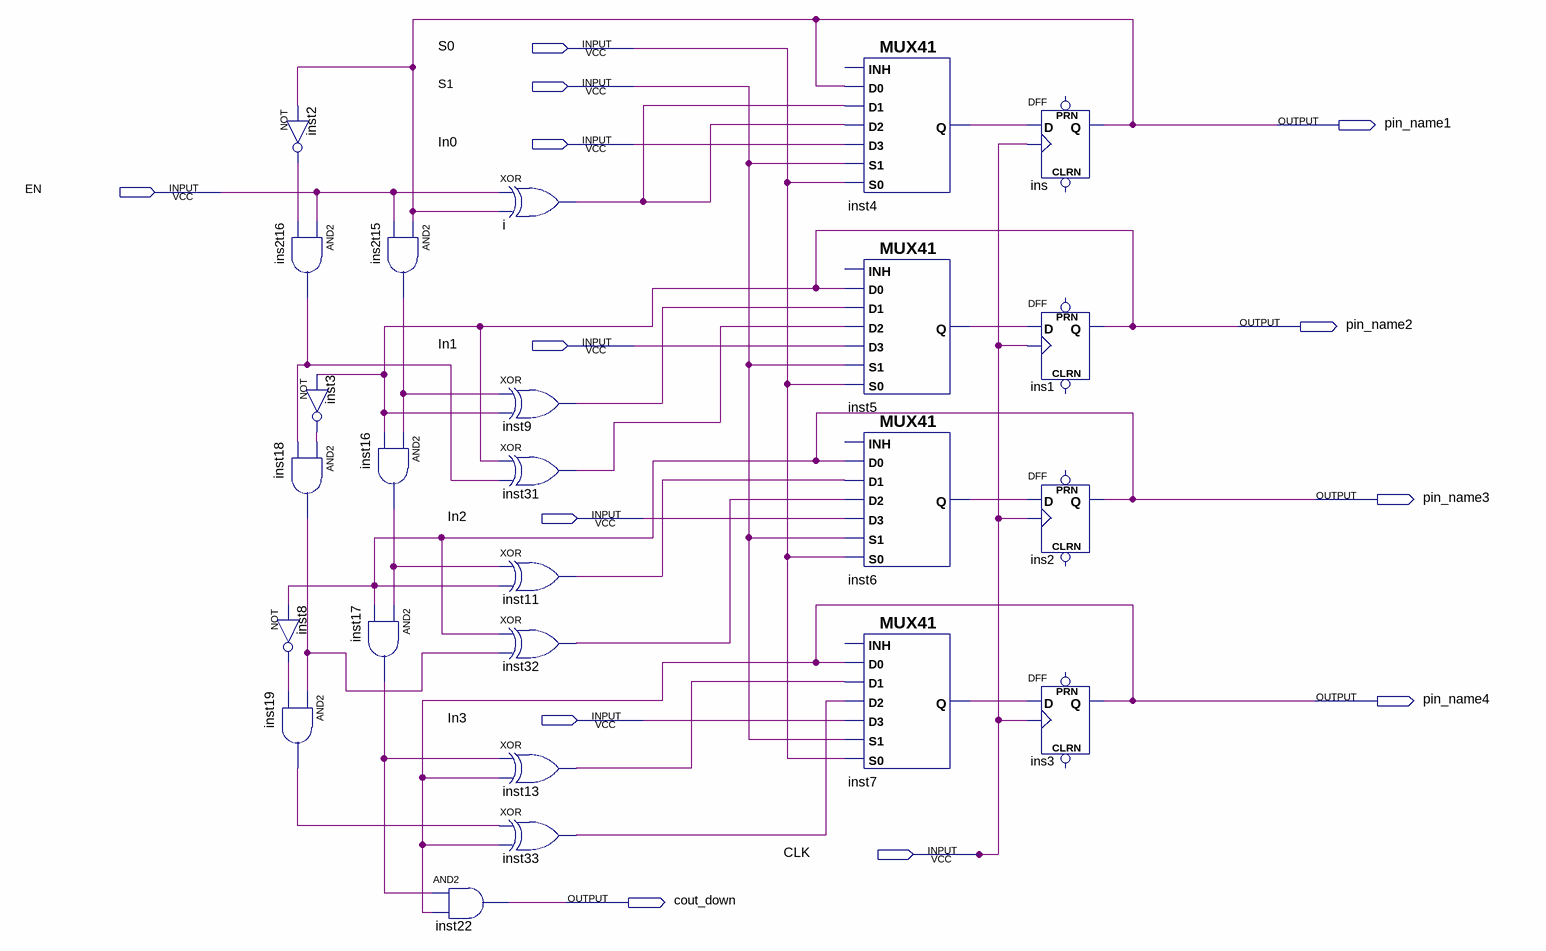
[diagram p0: schematic sheet]
// Quartus schematic CO_Counter.bdf as structural Verilog: 25 symbols, 13 pins
module CO_Counter (
  input  S0,
  input  S1,
  input  In0,
  input  EN,
  input  In1,
  input  In2,
  input  In3,
  input  CLK,
  output pin_name1,
  output pin_name2,
  output pin_name3,
  output pin_name4,
  output cout_down
);

  wire i_out, ins2t15_out, ins2t16_out, inst2_out, inst3_out, inst4_q, inst5_q, inst6_q, inst7_q, inst8_out,
       inst9_out, inst11_out, inst13_out, inst16_out, inst17_out, inst18_out, inst19_out, inst31_out,
       inst32_out, inst33_out;

  not inst2 (inst2_out, pin_name1);
  and ins2t16 (ins2t16_out, EN, inst2_out);
  not inst3 (inst3_out, pin_name2);
  and inst18 (inst18_out, inst3_out, ins2t16_out);
  not inst8 (inst8_out, pin_name3);
  and inst19 (inst19_out, inst18_out, inst8_out);
  and ins2t15 (ins2t15_out, pin_name1, EN);
  and inst16 (inst16_out, ins2t15_out, pin_name2);
  and inst17 (inst17_out, inst16_out, pin_name3);
  and inst22 (cout_down, inst17_out, pin_name4);
  xor i (i_out, EN, pin_name1);
  xor inst9 (inst9_out, ins2t15_out, pin_name2);
  xor inst31 (inst31_out, pin_name2, ins2t16_out);
  xor inst11 (inst11_out, inst16_out, pin_name3);
  xor inst32 (inst32_out, pin_name3, inst18_out);
  xor inst13 (inst13_out, inst17_out, pin_name4);
  xor inst33 (inst33_out, inst19_out, pin_name4);
  MUX41 inst4 (.S0(S0), .D2(i_out), .S1(S1), .D3(In0), .D0(pin_name1), .D1(i_out), .Q(inst4_q));  // open: INH
  MUX41 inst5 (.S0(S0), .D2(inst31_out), .S1(S1), .D3(In1), .D0(pin_name2), .D1(inst9_out), .Q(inst5_q));  // open: INH
  MUX41 inst6 (.S0(S0), .D2(inst32_out), .S1(S1), .D3(In2), .D0(pin_name3), .D1(inst11_out), .Q(inst6_q));  // open: INH
  MUX41 inst7 (.S0(S0), .D2(inst33_out), .S1(S1), .D3(In3), .D0(pin_name4), .D1(inst13_out), .Q(inst7_q));  // open: INH
  DFF ins (.CLK(CLK), .D(inst4_q), .Q(pin_name1));  // open: CLRN, PRN
  DFF ins1 (.CLK(CLK), .D(inst5_q), .Q(pin_name2));  // open: CLRN, PRN
  DFF ins2 (.CLK(CLK), .D(inst6_q), .Q(pin_name3));  // open: CLRN, PRN
  DFF ins3 (.CLK(CLK), .D(inst7_q), .Q(pin_name4));  // open: CLRN, PRN
endmodule
